# Altium project multi_channel.PrjPcb (part 2 of 2)

## Sheet Filter6.SchDoc
size 420 x 297 mm; SheetNumber: 11; SheetTotal: 13
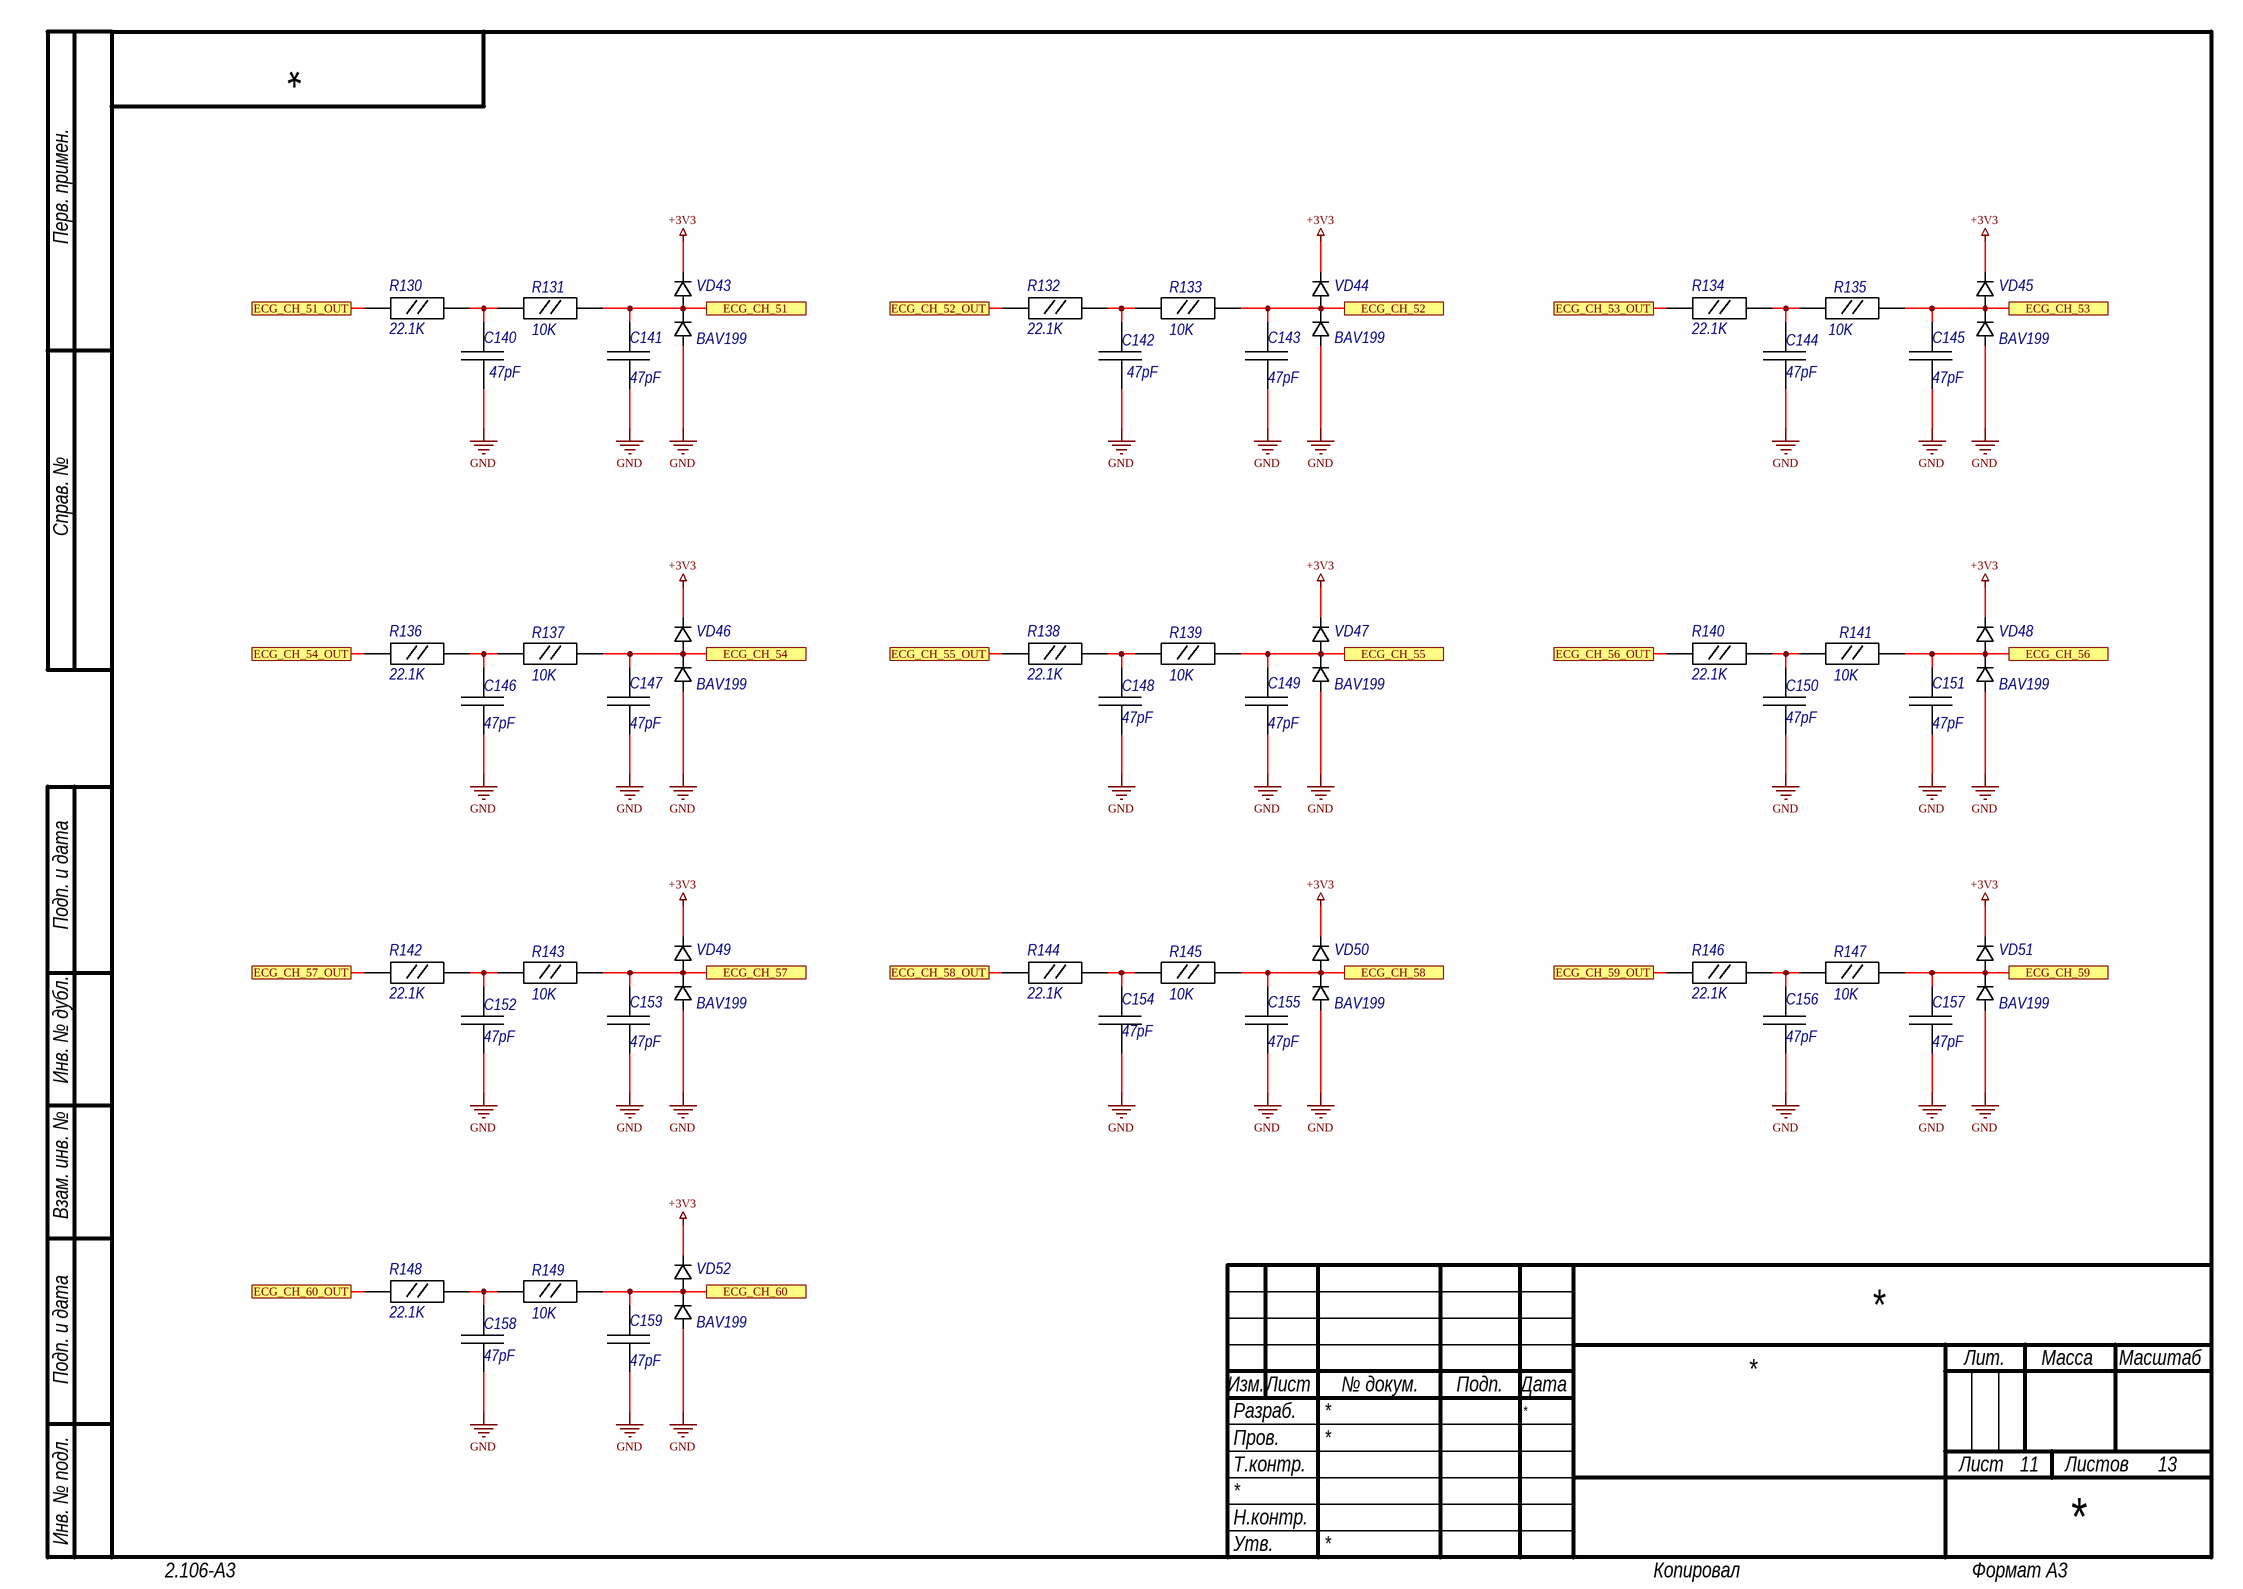
[diagram p10: Filter6.SchDoc]

### Parts
C140  47pF  [C0603]
C141  47pF  [C0603]
C142  47pF  [C0603]
C143  47pF  [C0603]
C144  47pF  [C0603]
C145  47pF  [C0603]
C146  47pF  [C0603]
C147  47pF  [C0603]
C148  47pF  [C0603]
C149  47pF  [C0603]
C150  47pF  [C0603]
C151  47pF  [C0603]
C152  47pF  [C0603]
C153  47pF  [C0603]
C154  47pF  [C0603]
C155  47pF  [C0603]
C156  47pF  [C0603]
C157  47pF  [C0603]
C158  47pF  [C0603]
C159  47pF  [C0603]
R130  22.1K  [R0603]
R131  10K  [R0603]
R132  22.1K  [R0603]
R133  10K  [R0603]
R134  22.1K  [R0603]
R135  10K  [R0603]
R136  22.1K  [R0603]
R137  10K  [R0603]
R138  22.1K  [R0603]
R139  10K  [R0603]
R140  22.1K  [R0603]
R141  10K  [R0603]
R142  22.1K  [R0603]
R143  10K  [R0603]
R144  22.1K  [R0603]
R145  10K  [R0603]
R146  22.1K  [R0603]
R147  10K  [R0603]
R148  22.1K  [R0603]
R149  10K  [R0603]
VD43  BAV199  [SOT23]
VD44  BAV199  [SOT23]
VD45  BAV199  [SOT23]
VD46  BAV199  [SOT23]
VD47  BAV199  [SOT23]
VD48  BAV199  [SOT23]
VD49  BAV199  [SOT23]
VD50  BAV199  [SOT23]
VD51  BAV199  [SOT23]
VD52  BAV199  [SOT23]

### Ports
ECG_CH_51, ECG_CH_51_OUT, ECG_CH_52, ECG_CH_52_OUT, ECG_CH_53, ECG_CH_53_OUT, ECG_CH_54, ECG_CH_54_OUT, ECG_CH_55, ECG_CH_55_OUT, ECG_CH_56, ECG_CH_56_OUT, ECG_CH_57, ECG_CH_57_OUT, ECG_CH_58, ECG_CH_58_OUT, ECG_CH_59, ECG_CH_59_OUT, ECG_CH_60, ECG_CH_60_OUT

### Nets
+3V3: VD43.2 VD44.2 VD45.2 VD46.2 VD47.2 VD48.2 VD49.2 VD50.2 VD51.2 VD52.2
GND: C140.1 C141.1 C142.1 C143.1 C144.1 C145.1 C146.1 C147.1 C148.1 C149.1 C150.1 C151.1 C152.1 C153.1 C154.1 C155.1 C156.1 C157.1 C158.1 C159.1 VD43.1 VD44.1 VD45.1 VD46.1 VD47.1 VD48.1 VD49.1 VD50.1 VD51.1 VD52.1
NetC140_2: C140.2 R130.2 R131.1
NetC141_2: C141.2 R131.2 VD43.3 ; port ECG_CH_51
NetC142_2: C142.2 R132.2 R133.1
NetC143_2: C143.2 R133.2 VD44.3 ; port ECG_CH_52
NetC144_2: C144.2 R134.2 R135.1
NetC145_2: C145.2 R135.2 VD45.3 ; port ECG_CH_53
NetC146_2: C146.2 R136.2 R137.1
NetC147_2: C147.2 R137.2 VD46.3 ; port ECG_CH_54
NetC148_2: C148.2 R138.2 R139.1
NetC149_2: C149.2 R139.2 VD47.3 ; port ECG_CH_55
NetC150_2: C150.2 R140.2 R141.1
NetC151_2: C151.2 R141.2 VD48.3 ; port ECG_CH_56
NetC152_2: C152.2 R142.2 R143.1
NetC153_2: C153.2 R143.2 VD49.3 ; port ECG_CH_57
NetC154_2: C154.2 R144.2 R145.1
NetC155_2: C155.2 R145.2 VD50.3 ; port ECG_CH_58
NetC156_2: C156.2 R146.2 R147.1
NetC157_2: C157.2 R147.2 VD51.3 ; port ECG_CH_59
NetC158_2: C158.2 R148.2 R149.1
NetC159_2: C159.2 R149.2 VD52.3 ; port ECG_CH_60
NetR130_1: R130.1 ; port ECG_CH_51_OUT
NetR132_1: R132.1 ; port ECG_CH_52_OUT
NetR134_1: R134.1 ; port ECG_CH_53_OUT
NetR136_1: R136.1 ; port ECG_CH_54_OUT
NetR138_1: R138.1 ; port ECG_CH_55_OUT
NetR140_1: R140.1 ; port ECG_CH_56_OUT
NetR142_1: R142.1 ; port ECG_CH_57_OUT
NetR144_1: R144.1 ; port ECG_CH_58_OUT
NetR146_1: R146.1 ; port ECG_CH_59_OUT
NetR148_1: R148.1 ; port ECG_CH_60_OUT

### Notes on the sheet
- Перв. примен.
- Справ. №
- Подп. и дата
- Инв. № дубл.
- Взам. инв. №
- Разраб.
- Изм.
- Лист
- № докум.
- Подп.
- Дата
- Лит.
- Масса
- Масштаб
- Пров.
- Т.контр.
- Листов
- Инв. № подл.
- Утв.
- Н.контр.
- 2.106-A3
- Копировал
- Формат А3

### Library data of the parts
C140-C159 = CC_SMD_0603: Ceramic Capacitor SMD; Package: 0603; Value: 47pF
R130-R149 = R0603: Resistor SMD
  R130 R132 R134 R136 R138 R140 R142 R144 R146 R148: Value: 22.1K
  R131 R133 R135 R137 R139 R141 R143 R145 R147 R149: Value: 10K
VD43-VD52 = DIODE_BAV199: Diod Schottky; Diode Type: Standard; Package: SOT-23; PartNumber: BAV199; Manufacturer Part Number 1: BAV199

## Sheet Connectors.SchDoc
size 420 x 297 mm; SheetNumber: 13; SheetTotal: 13
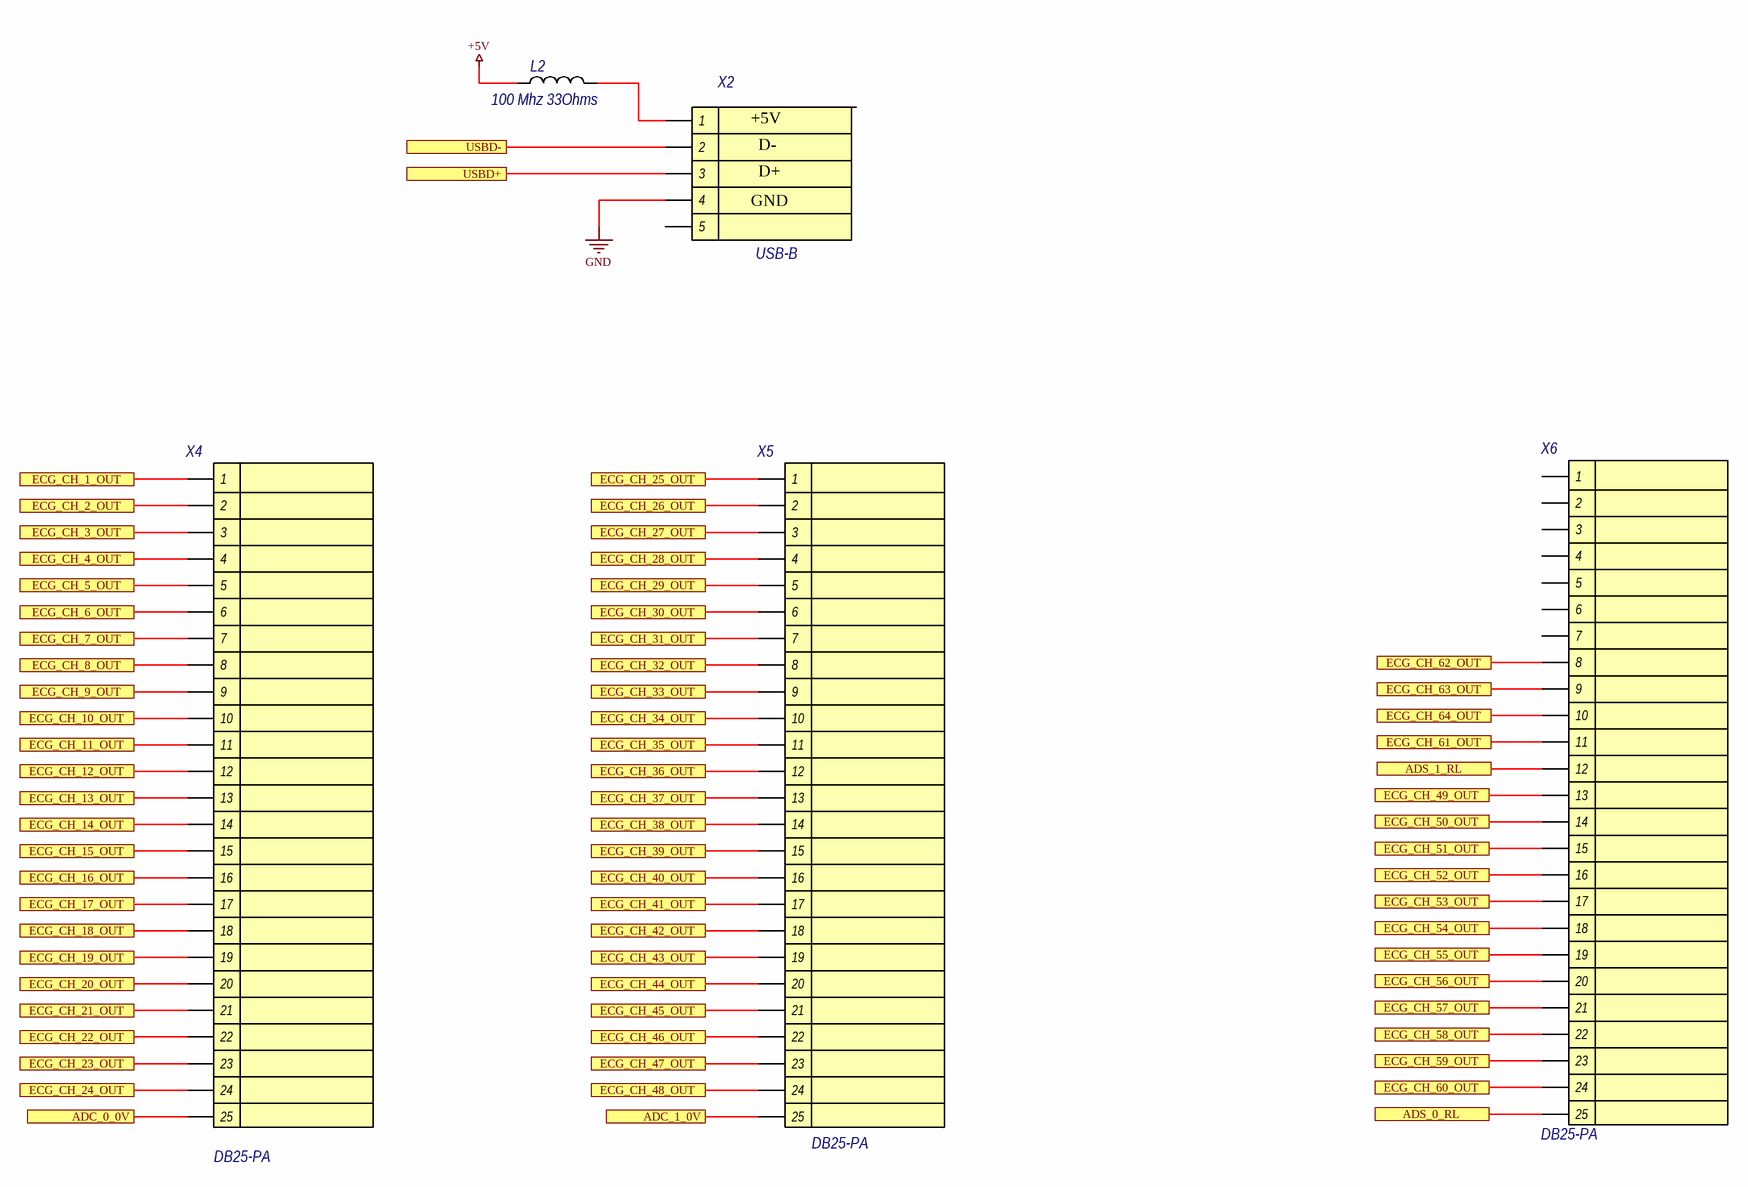
[diagram p11: Connectors.SchDoc]

### Parts
L2  100 Mhz 33Ohms  [1206]
X2  USB-B  [USB-B]
X4  DB25-PA  [DB25_FEMALE]
X5  DB25-PA  [DB25_FEMALE]
X6  DB25-PA  [DB25_FEMALE]

### Ports
ADC_0_0V, ADC_1_0V, ADS_0_RL, ADS_1_RL, ECG_CH_1_OUT, ECG_CH_2_OUT, ECG_CH_3_OUT, ECG_CH_4_OUT, ECG_CH_5_OUT, ECG_CH_6_OUT, ECG_CH_7_OUT, ECG_CH_8_OUT, ECG_CH_9_OUT, ECG_CH_10_OUT, ECG_CH_11_OUT, ECG_CH_12_OUT, ECG_CH_13_OUT, ECG_CH_14_OUT, ECG_CH_15_OUT, ECG_CH_16_OUT, ECG_CH_17_OUT, ECG_CH_18_OUT, ECG_CH_19_OUT, ECG_CH_20_OUT, ECG_CH_21_OUT, ECG_CH_22_OUT, ECG_CH_23_OUT, ECG_CH_24_OUT, ECG_CH_25_OUT, ECG_CH_26_OUT, ECG_CH_27_OUT, ECG_CH_28_OUT, ECG_CH_29_OUT, ECG_CH_30_OUT, ECG_CH_31_OUT, ECG_CH_32_OUT, ECG_CH_33_OUT, ECG_CH_34_OUT, ECG_CH_35_OUT, ECG_CH_36_OUT, ECG_CH_37_OUT, ECG_CH_38_OUT, ECG_CH_39_OUT, ECG_CH_40_OUT, ECG_CH_41_OUT, ECG_CH_42_OUT, ECG_CH_43_OUT, ECG_CH_44_OUT, ECG_CH_45_OUT, ECG_CH_46_OUT, ECG_CH_47_OUT, ECG_CH_48_OUT, ECG_CH_49_OUT, ECG_CH_50_OUT, ECG_CH_51_OUT, ECG_CH_52_OUT, ECG_CH_53_OUT, ECG_CH_54_OUT, ECG_CH_55_OUT, ECG_CH_56_OUT, ECG_CH_57_OUT, ECG_CH_58_OUT, ECG_CH_59_OUT, ECG_CH_60_OUT, ECG_CH_61_OUT, ECG_CH_62_OUT, ECG_CH_63_OUT, ECG_CH_64_OUT, USBD+, USBD-

### Nets
+5V: L2.1
GND: X2.4
NetB1_1: X4.25 ; port ADC_0_0V
NetB2_1: X5.25 ; port ADC_1_0V
NetDD2_15: X2.3 ; port USBD+
NetDD2_16: X2.2 ; port USBD-
NetL2_2: L2.2 X2.1
NetR13_1: X6.25 ; port ADS_0_RL
NetR19_1: X6.11 ; port ECG_CH_61_OUT
NetR21_1: X6.8 ; port ECG_CH_62_OUT
NetR34_1: X6.12 ; port ADS_1_RL
NetR38_1: X6.9 ; port ECG_CH_63_OUT
NetR50_1: X4.1 ; port ECG_CH_1_OUT
NetR52_1: X4.2 ; port ECG_CH_2_OUT
NetR54_1: X4.3 ; port ECG_CH_3_OUT
NetR56_1: X4.4 ; port ECG_CH_4_OUT
NetR58_1: X4.5 ; port ECG_CH_5_OUT
NetR60_1: X4.6 ; port ECG_CH_6_OUT
NetR62_1: X4.7 ; port ECG_CH_7_OUT
NetR64_1: X4.8 ; port ECG_CH_8_OUT
NetR66_1: X4.9 ; port ECG_CH_9_OUT
NetR68_1: X4.10 ; port ECG_CH_10_OUT
NetR70_1: X4.11 ; port ECG_CH_11_OUT
NetR72_1: X4.12 ; port ECG_CH_12_OUT
NetR74_1: X4.13 ; port ECG_CH_13_OUT
NetR76_1: X4.14 ; port ECG_CH_14_OUT
NetR78_1: X4.15 ; port ECG_CH_15_OUT
NetR80_1: X4.16 ; port ECG_CH_16_OUT
NetR82_1: X4.17 ; port ECG_CH_17_OUT
NetR84_1: X4.18 ; port ECG_CH_18_OUT
NetR86_1: X4.19 ; port ECG_CH_19_OUT
NetR88_1: X4.20 ; port ECG_CH_20_OUT
NetR90_1: X5.7 ; port ECG_CH_31_OUT
NetR92_1: X5.8 ; port ECG_CH_32_OUT
NetR94_1: X5.9 ; port ECG_CH_33_OUT
NetR96_1: X5.10 ; port ECG_CH_34_OUT
NetR98_1: X5.11 ; port ECG_CH_35_OUT
NetR100_1: X5.12 ; port ECG_CH_36_OUT
NetR102_1: X5.13 ; port ECG_CH_37_OUT
NetR104_1: X5.14 ; port ECG_CH_38_OUT
NetR106_1: X5.15 ; port ECG_CH_39_OUT
NetR108_1: X5.16 ; port ECG_CH_40_OUT
NetR110_1: X5.17 ; port ECG_CH_41_OUT
NetR112_1: X5.18 ; port ECG_CH_42_OUT
NetR114_1: X5.19 ; port ECG_CH_43_OUT
NetR116_1: X5.20 ; port ECG_CH_44_OUT
NetR118_1: X5.21 ; port ECG_CH_45_OUT
NetR120_1: X5.22 ; port ECG_CH_46_OUT
NetR122_1: X5.23 ; port ECG_CH_47_OUT
NetR124_1: X5.24 ; port ECG_CH_48_OUT
NetR126_1: X6.13 ; port ECG_CH_49_OUT
NetR128_1: X6.14 ; port ECG_CH_50_OUT
NetR130_1: X6.15 ; port ECG_CH_51_OUT
NetR132_1: X6.16 ; port ECG_CH_52_OUT
NetR134_1: X6.17 ; port ECG_CH_53_OUT
NetR136_1: X6.18 ; port ECG_CH_54_OUT
NetR138_1: X6.19 ; port ECG_CH_55_OUT
NetR140_1: X6.20 ; port ECG_CH_56_OUT
NetR142_1: X6.21 ; port ECG_CH_57_OUT
NetR144_1: X6.22 ; port ECG_CH_58_OUT
NetR146_1: X6.23 ; port ECG_CH_59_OUT
NetR148_1: X6.24 ; port ECG_CH_60_OUT
NetR151_1: X6.10 ; port ECG_CH_64_OUT
NetR158_1: X4.21 ; port ECG_CH_21_OUT
NetR160_1: X4.22 ; port ECG_CH_22_OUT
NetR162_1: X4.23 ; port ECG_CH_23_OUT
NetR164_1: X4.24 ; port ECG_CH_24_OUT
NetR166_1: X5.1 ; port ECG_CH_25_OUT
NetR168_1: X5.2 ; port ECG_CH_26_OUT
NetR170_1: X5.3 ; port ECG_CH_27_OUT
NetR172_1: X5.4 ; port ECG_CH_28_OUT
NetR174_1: X5.5 ; port ECG_CH_29_OUT
NetR176_1: X5.6 ; port ECG_CH_30_OUT

Not connected (* = marked no-connect by the designer): X2 5; X6 1 2 3 4 5 6 7

### Notes on the sheet
- +5V
- D-
- GND
- D+
- Перв. примен.
- Справ. №
- Подп. и дата
- Инв. № дубл.
- Взам. инв. №
- Разраб.
- Изм.
- Лист
- № докум.
- Подп.
- Дата
- Лит.
- Масса
- Масштаб
- Пров.
- Т.контр.
- Листов
- Инв. № подл.
- Утв.
- Н.контр.
- 2.106-A3
- Копировал
- Формат А3

### Library data of the parts
L2 = IND_BLM31PG330SN1L: Ferrite Bead; Manufacturer 1: Coilcraft; Tolerance: ±10%; SCDType: spec; Package: 1206; PartNumber: BLM31PG330SN1L; Manufacturer Part Number 1: 100 Mhz 33Ohms
X2 = CONN_USB-B: STD USB TYPE B; Manufacturer: TE Connectivity; Part Number: 292317-4; Desc: Разъем на плату
X4-X6 = CONN_DB25_FEMALE: Value: DB25-PA; PartNumber: DB25-PA

## Sheet Filter7.SchDoc
size 420 x 297 mm; SheetNumber: 13; SheetTotal: 13
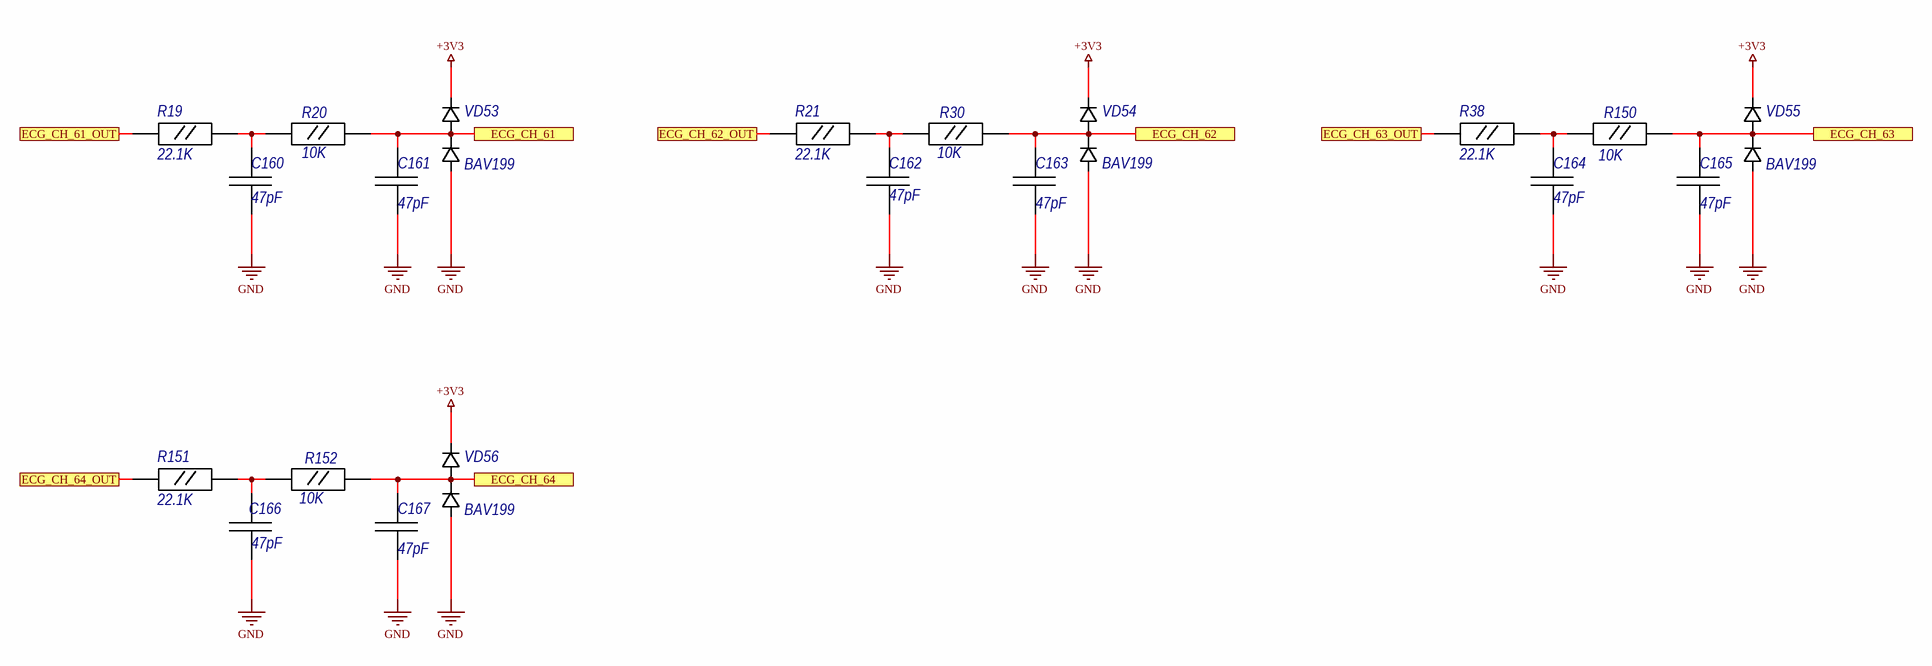
[diagram p12: Filter7.SchDoc]

### Parts
C160  47pF  [C0603]
C161  47pF  [C0603]
C162  47pF  [C0603]
C163  47pF  [C0603]
C164  47pF  [C0603]
C165  47pF  [C0603]
C166  47pF  [C0603]
C167  47pF  [C0603]
R19  22.1K  [R0603]
R20  10K  [R0603]
R21  22.1K  [R0603]
R30  10K  [R0603]
R38  22.1K  [R0603]
R150  10K  [R0603]
R151  22.1K  [R0603]
R152  10K  [R0603]
VD53  BAV199  [SOT23]
VD54  BAV199  [SOT23]
VD55  BAV199  [SOT23]
VD56  BAV199  [SOT23]

### Ports
ECG_CH_61, ECG_CH_61_OUT, ECG_CH_62, ECG_CH_62_OUT, ECG_CH_63, ECG_CH_63_OUT, ECG_CH_64, ECG_CH_64_OUT

### Nets
+3V3: VD53.2 VD54.2 VD55.2 VD56.2
GND: C160.1 C161.1 C162.1 C163.1 C164.1 C165.1 C166.1 C167.1 VD53.1 VD54.1 VD55.1 VD56.1
NetC160_2: C160.2 R19.2 R20.1
NetC161_2: C161.2 R20.2 VD53.3 ; port ECG_CH_61
NetC162_2: C162.2 R21.2 R30.1
NetC163_2: C163.2 R30.2 VD54.3 ; port ECG_CH_62
NetC164_2: C164.2 R38.2 R150.1
NetC165_2: C165.2 R150.2 VD55.3 ; port ECG_CH_63
NetC166_2: C166.2 R151.2 R152.1
NetC167_2: C167.2 R152.2 VD56.3 ; port ECG_CH_64
NetR19_1: R19.1 ; port ECG_CH_61_OUT
NetR21_1: R21.1 ; port ECG_CH_62_OUT
NetR38_1: R38.1 ; port ECG_CH_63_OUT
NetR151_1: R151.1 ; port ECG_CH_64_OUT

### Notes on the sheet
- Перв. примен.
- Справ. №
- Подп. и дата
- Инв. № дубл.
- Взам. инв. №
- Разраб.
- Изм.
- Лист
- № докум.
- Подп.
- Дата
- Лит.
- Масса
- Масштаб
- Пров.
- Т.контр.
- Листов
- Инв. № подл.
- Утв.
- Н.контр.
- 2.106-A3
- Копировал
- Формат А3

### Library data of the parts
C160-C167 = CC_SMD_0603: Ceramic Capacitor SMD; Package: 0603; Value: 47pF
R19-R21 R30 R38 R150-R152 = R0603: Resistor SMD
  R19 R21 R38 R151: Value: 22.1K
  R20 R30 R150 R152: Value: 10K
VD53-VD56 = DIODE_BAV199: Diod Schottky; Diode Type: Standard; Package: SOT-23; PartNumber: BAV199; Manufacturer Part Number 1: BAV199

## Nets that join several sheets
+3V3: MCU (21 pins), ADC_0 (23 pins), ADC_0_MUL (24 pins), ADC_1 (20 pins), ADC_1_MUL (24 pins), Filter1 (10 pins), Filter2 (10 pins), Filter3 (10 pins), Filter4 (10 pins), Filter5 (10 pins), Filter6 (10 pins), Filter7 (VD53.2 VD54.2 VD55.2 VD56.2)
+5V: MCU (10 pins), Connectors (L2.1)
GND: MCU (37 pins), ADC_0 (29 pins), ADC_0_MUL (16 pins), ADC_1 (27 pins), ADC_1_MUL (16 pins), Filter1 (30 pins), Filter2 (30 pins), Filter3 (30 pins), Filter4 (30 pins), Filter5 (30 pins), Filter6 (30 pins), Connectors (X2.4), Filter7 (12 pins)
NetB1_1: ADC_0 (8 pins), Connectors (X4.25)
NetB1_2: ADC_0 (B1.2), ADC_0_MUL (DD3.8)
NetB1_4: ADC_0 (B1.4), ADC_0_MUL (DD8.8)
NetB1_6: ADC_0 (B1.6), ADC_0_MUL (DD6.8)
NetB1_8: ADC_0 (B1.8), ADC_0_MUL (DD7.8)
NetB1_10: ADC_0 (B1.10), ADC_1_MUL (DD16.8)
NetB1_12: ADC_0 (B1.12), ADC_1_MUL (DD17.8)
NetB1_14: ADC_0 (B1.14), ADC_1_MUL (DD15.8)
NetB1_16: ADC_0 (B1.16), ADC_1_MUL (DD18.8)
NetB1_34: MCU (R17.1), ADC_0 (B1.34), ADC_1 (B2.34)
NetB1_37: ADC_0 (B1.37 DA2.3), ADC_1 (B2.37)
NetB1_38: MCU (DD1.52), ADC_0 (B1.38 R40.2)
NetB1_39: MCU (DD1.48), ADC_0 (B1.39 R36.1)
NetB1_40: MCU (R10.1), ADC_0 (B1.40), ADC_1 (B2.40)
NetB1_43: MCU (R18.1), ADC_0 (B1.43), ADC_1 (B2.43)
NetB1_47: MCU (DD1.51), ADC_0 (B1.47 R15.1)
NetB2_1: ADC_1 (8 pins), Connectors (X5.25)
NetB2_2: ADC_0_MUL (DD10.8), ADC_1 (B2.2)
NetB2_4: ADC_1 (B2.4), ADC_1_MUL (DD11.8)
NetB2_6: ADC_0_MUL (DD9.8), ADC_1 (B2.6)
NetB2_8: ADC_1 (B2.8), ADC_1_MUL (DD14.8)
NetB2_10: ADC_1 (B2.10), ADC_1_MUL (DD12.8)
NetB2_12: ADC_1 (B2.12), ADC_1_MUL (DD13.8)
NetB2_14: ADC_0_MUL (DD4.8), ADC_1 (B2.14)
NetB2_16: ADC_0_MUL (DD5.8), ADC_1 (B2.16)
NetB2_38: MCU (DD1.26), ADC_1 (B2.38 R184.2)
NetB2_39: MCU (DD1.29), ADC_1 (B2.39 R182.1)
NetB2_47: MCU (DD1.30), ADC_1 (B2.47 R41.1)
NetC61_2: ADC_0_MUL (DD4.4), Filter1 (C61.2 R51.2 VD3.3)
NetC63_2: ADC_0_MUL (DD4.2), Filter1 (C63.2 R53.2 VD4.3)
NetC65_2: ADC_0_MUL (DD4.9), Filter1 (C65.2 R55.2 VD5.3)
NetC67_2: ADC_0_MUL (DD4.7), Filter1 (C67.2 R57.2 VD6.3)
NetC69_2: ADC_0_MUL (DD3.4), Filter1 (C69.2 R59.2 VD7.3)
NetC71_2: ADC_0_MUL (DD3.2), Filter1 (C71.2 R61.2 VD8.3)
NetC73_2: ADC_0_MUL (DD3.9), Filter1 (C73.2 R63.2 VD9.3)
NetC75_2: ADC_0_MUL (DD3.7), Filter1 (C75.2 R65.2 VD10.3)
NetC77_2: ADC_0_MUL (DD6.4), Filter1 (C77.2 R67.2 VD11.3)
NetC79_2: ADC_0_MUL (DD6.2), Filter1 (C79.2 R69.2 VD12.3)
NetC81_2: ADC_0_MUL (DD6.9), Filter2 (C81.2 R71.2 VD13.3)
NetC83_2: ADC_0_MUL (DD6.7), Filter2 (C83.2 R73.2 VD14.3)
NetC85_2: ADC_0_MUL (DD5.4), Filter2 (C85.2 R75.2 VD15.3)
NetC87_2: ADC_0_MUL (DD5.2), Filter2 (C87.2 R77.2 VD16.3)
NetC89_2: ADC_0_MUL (DD5.9), Filter2 (C89.2 R79.2 VD17.3)
NetC91_2: ADC_0_MUL (DD5.7), Filter2 (C91.2 R81.2 VD18.3)
NetC93_2: ADC_0_MUL (DD8.4), Filter2 (C93.2 R83.2 VD19.3)
NetC95_2: ADC_0_MUL (DD8.2), Filter2 (C95.2 R85.2 VD20.3)
NetC97_2: ADC_0_MUL (DD8.9), Filter2 (C97.2 R87.2 VD21.3)
NetC99_2: ADC_0_MUL (DD8.7), Filter2 (C99.2 R89.2 VD22.3)
NetC101_2: ADC_0_MUL (DD9.4), Filter4 (C101.2 R91.2 VD23.3)
NetC103_2: ADC_0_MUL (DD9.2), Filter4 (C103.2 R93.2 VD24.3)
NetC105_2: ADC_1_MUL (DD12.9), Filter4 (C105.2 R95.2 VD25.3)
NetC107_2: ADC_1_MUL (DD12.7), Filter4 (C107.2 R97.2 VD26.3)
NetC109_2: ADC_1_MUL (DD12.4), Filter4 (C109.2 R99.2 VD27.3)
NetC111_2: ADC_1_MUL (DD12.2), Filter4 (C111.2 R101.2 VD28.3)
NetC113_2: ADC_1_MUL (DD11.2), Filter4 (C113.2 R103.2 VD29.3)
NetC115_2: ADC_1_MUL (DD11.9), Filter4 (C115.2 R105.2 VD30.3)
NetC117_2: ADC_1_MUL (DD11.7), Filter4 (C117.2 R107.2 VD31.3)
NetC119_2: ADC_1_MUL (DD11.4), Filter4 (C119.2 R109.2 VD32.3)
NetC121_2: ADC_1_MUL (DD14.9), Filter5 (C121.2 R111.2 VD33.3)
NetC123_2: ADC_1_MUL (DD14.7), Filter5 (C123.2 R113.2 VD34.3)
NetC125_2: ADC_1_MUL (DD14.4), Filter5 (C125.2 R115.2 VD35.3)
NetC127_2: ADC_1_MUL (DD14.2), Filter5 (C127.2 R117.2 VD36.3)
NetC129_2: ADC_1_MUL (DD13.9), Filter5 (C129.2 R119.2 VD37.3)
NetC131_2: ADC_1_MUL (DD13.7), Filter5 (C131.2 R121.2 VD38.3)
NetC133_2: ADC_1_MUL (DD13.4), Filter5 (C133.2 R123.2 VD39.3)
NetC135_2: ADC_1_MUL (DD13.2), Filter5 (C135.2 R125.2 VD40.3)
NetC137_2: ADC_1_MUL (DD16.2), Filter5 (C137.2 R127.2 VD41.3)
NetC139_2: ADC_1_MUL (DD16.4), Filter5 (C139.2 R129.2 VD42.3)
NetC141_2: ADC_1_MUL (DD16.7), Filter6 (C141.2 R131.2 VD43.3)
NetC143_2: ADC_1_MUL (DD16.9), Filter6 (C143.2 R133.2 VD44.3)
NetC145_2: ADC_1_MUL (DD15.2), Filter6 (C145.2 R135.2 VD45.3)
NetC147_2: ADC_1_MUL (DD15.4), Filter6 (C147.2 R137.2 VD46.3)
NetC149_2: ADC_1_MUL (DD15.7), Filter6 (C149.2 R139.2 VD47.3)
NetC151_2: ADC_1_MUL (DD15.9), Filter6 (C151.2 R141.2 VD48.3)
NetC153_2: ADC_1_MUL (DD18.2), Filter6 (C153.2 R143.2 VD49.3)
NetC155_2: ADC_1_MUL (DD18.4), Filter6 (C155.2 R145.2 VD50.3)
NetC157_2: ADC_1_MUL (DD18.7), Filter6 (C157.2 R147.2 VD51.3)
NetC159_2: ADC_1_MUL (DD18.9), Filter6 (C159.2 R149.2 VD52.3)
NetC161_2: ADC_1_MUL (DD17.9), Filter7 (C161.2 R20.2 VD53.3)
NetC163_2: ADC_1_MUL (DD17.2), Filter7 (C163.2 R30.2 VD54.3)
NetC165_2: ADC_1_MUL (DD17.4), Filter7 (C165.2 R150.2 VD55.3)
NetC167_2: ADC_1_MUL (DD17.7), Filter7 (C167.2 R152.2 VD56.3)
NetC169_2: ADC_0_MUL (DD7.4), Filter3 (C169.2 R159.2 VD57.3)
NetC171_2: ADC_0_MUL (DD7.2), Filter3 (C171.2 R161.2 VD58.3)
NetC173_2: ADC_0_MUL (DD7.9), Filter3 (C173.2 R163.2 VD59.3)
NetC175_2: ADC_0_MUL (DD7.7), Filter3 (C175.2 R165.2 VD60.3)
NetC177_2: ADC_0_MUL (DD10.9), Filter3 (C177.2 R167.2 VD61.3)
NetC179_2: ADC_0_MUL (DD10.7), Filter3 (C179.2 R169.2 VD62.3)
NetC181_2: ADC_0_MUL (DD10.4), Filter3 (C181.2 R171.2 VD63.3)
NetC183_2: ADC_0_MUL (DD10.2), Filter3 (C183.2 R173.2 VD64.3)
NetC185_2: ADC_0_MUL (DD9.9), Filter3 (C185.2 R175.2 VD65.3)
NetC187_2: ADC_0_MUL (DD9.7), Filter3 (C187.2 R177.2 VD66.3)
NetDD1_34: MCU (DD1.34), ADC_0_MUL (DD10.1)
NetDD1_35: MCU (DD1.35), ADC_0_MUL (DD10.10)
NetDD1_36: MCU (DD1.36), ADC_1_MUL (DD11.1)
NetDD1_38: MCU (DD1.38), ADC_1_MUL (DD11.10)
NetDD1_39: MCU (DD1.39), ADC_0_MUL (DD9.1)
NetDD1_40: MCU (DD1.40), ADC_0_MUL (DD9.10)
NetDD1_41: MCU (DD1.41), ADC_1_MUL (DD14.1)
NetDD1_42: MCU (DD1.42), ADC_1_MUL (DD14.10)
NetDD1_43: MCU (DD1.43), ADC_1_MUL (DD12.1)
NetDD1_44: MCU (DD1.44), ADC_1_MUL (DD12.10)
NetDD1_45: MCU (DD1.45), ADC_1_MUL (DD13.1)
NetDD1_46: MCU (DD1.46), ADC_1_MUL (DD13.10)
NetDD1_47: MCU (DD1.47), ADC_0_MUL (DD5.10)
NetDD1_53: MCU (DD1.53), ADC_0_MUL (DD5.1)
NetDD1_54: MCU (DD1.54), ADC_0_MUL (DD4.1)
NetDD1_55: MCU (DD1.55), ADC_0_MUL (DD4.10)
NetDD1_56: MCU (DD1.56), ADC_0_MUL (DD8.1)
NetDD1_57: MCU (DD1.57), ADC_0_MUL (DD8.10)
NetDD1_58: MCU (DD1.58), ADC_0_MUL (DD3.1)
NetDD1_59: MCU (DD1.59), ADC_0_MUL (DD3.10)
NetDD1_60: MCU (DD1.60), ADC_0_MUL (DD7.1)
NetDD1_61: MCU (DD1.61), ADC_0_MUL (DD7.10)
NetDD1_62: MCU (DD1.62), ADC_0_MUL (DD6.1)
NetDD1_63: MCU (DD1.63), ADC_0_MUL (DD6.10)
NetDD1_64: MCU (DD1.64), ADC_1_MUL (DD16.1)
NetDD1_65: MCU (DD1.65), ADC_1_MUL (DD16.10)
NetDD1_66: MCU (DD1.66), ADC_1_MUL (DD17.1)
NetDD1_67: MCU (DD1.67), ADC_1_MUL (DD17.10)
NetDD1_68: MCU (DD1.68), ADC_1_MUL (DD15.1)
NetDD1_69: MCU (DD1.69), ADC_1_MUL (DD15.10)
NetDD1_70: MCU (DD1.70), ADC_1_MUL (DD18.1)
NetDD1_71: MCU (DD1.71), ADC_1_MUL (DD18.10)
NetDD2_15: MCU (DD2.15), Connectors (X2.3)
NetDD2_16: MCU (DD2.16), Connectors (X2.2)
NetR13_1: ADC_0 (R13.1), Connectors (X6.25)
NetR19_1: Connectors (X6.11), Filter7 (R19.1)
NetR21_1: Connectors (X6.8), Filter7 (R21.1)
NetR34_1: ADC_1 (R34.1), Connectors (X6.12)
NetR38_1: Connectors (X6.9), Filter7 (R38.1)
NetR50_1: Filter1 (R50.1), Connectors (X4.1)
NetR52_1: Filter1 (R52.1), Connectors (X4.2)
NetR54_1: Filter1 (R54.1), Connectors (X4.3)
NetR56_1: Filter1 (R56.1), Connectors (X4.4)
NetR58_1: Filter1 (R58.1), Connectors (X4.5)
NetR60_1: Filter1 (R60.1), Connectors (X4.6)
NetR62_1: Filter1 (R62.1), Connectors (X4.7)
NetR64_1: Filter1 (R64.1), Connectors (X4.8)
NetR66_1: Filter1 (R66.1), Connectors (X4.9)
NetR68_1: Filter1 (R68.1), Connectors (X4.10)
NetR70_1: Filter2 (R70.1), Connectors (X4.11)
NetR72_1: Filter2 (R72.1), Connectors (X4.12)
NetR74_1: Filter2 (R74.1), Connectors (X4.13)
NetR76_1: Filter2 (R76.1), Connectors (X4.14)
NetR78_1: Filter2 (R78.1), Connectors (X4.15)
NetR80_1: Filter2 (R80.1), Connectors (X4.16)
NetR82_1: Filter2 (R82.1), Connectors (X4.17)
NetR84_1: Filter2 (R84.1), Connectors (X4.18)
NetR86_1: Filter2 (R86.1), Connectors (X4.19)
NetR88_1: Filter2 (R88.1), Connectors (X4.20)
NetR90_1: Filter4 (R90.1), Connectors (X5.7)
NetR92_1: Filter4 (R92.1), Connectors (X5.8)
NetR94_1: Filter4 (R94.1), Connectors (X5.9)
NetR96_1: Filter4 (R96.1), Connectors (X5.10)
NetR98_1: Filter4 (R98.1), Connectors (X5.11)
NetR100_1: Filter4 (R100.1), Connectors (X5.12)
NetR102_1: Filter4 (R102.1), Connectors (X5.13)
NetR104_1: Filter4 (R104.1), Connectors (X5.14)
NetR106_1: Filter4 (R106.1), Connectors (X5.15)
NetR108_1: Filter4 (R108.1), Connectors (X5.16)
NetR110_1: Filter5 (R110.1), Connectors (X5.17)
NetR112_1: Filter5 (R112.1), Connectors (X5.18)
NetR114_1: Filter5 (R114.1), Connectors (X5.19)
NetR116_1: Filter5 (R116.1), Connectors (X5.20)
NetR118_1: Filter5 (R118.1), Connectors (X5.21)
NetR120_1: Filter5 (R120.1), Connectors (X5.22)
NetR122_1: Filter5 (R122.1), Connectors (X5.23)
NetR124_1: Filter5 (R124.1), Connectors (X5.24)
NetR126_1: Filter5 (R126.1), Connectors (X6.13)
NetR128_1: Filter5 (R128.1), Connectors (X6.14)
NetR130_1: Filter6 (R130.1), Connectors (X6.15)
NetR132_1: Filter6 (R132.1), Connectors (X6.16)
NetR134_1: Filter6 (R134.1), Connectors (X6.17)
NetR136_1: Filter6 (R136.1), Connectors (X6.18)
NetR138_1: Filter6 (R138.1), Connectors (X6.19)
NetR140_1: Filter6 (R140.1), Connectors (X6.20)
NetR142_1: Filter6 (R142.1), Connectors (X6.21)
NetR144_1: Filter6 (R144.1), Connectors (X6.22)
NetR146_1: Filter6 (R146.1), Connectors (X6.23)
NetR148_1: Filter6 (R148.1), Connectors (X6.24)
NetR151_1: Connectors (X6.10), Filter7 (R151.1)
NetR158_1: Filter3 (R158.1), Connectors (X4.21)
NetR160_1: Filter3 (R160.1), Connectors (X4.22)
NetR162_1: Filter3 (R162.1), Connectors (X4.23)
NetR164_1: Filter3 (R164.1), Connectors (X4.24)
NetR166_1: Filter3 (R166.1), Connectors (X5.1)
NetR168_1: Filter3 (R168.1), Connectors (X5.2)
NetR170_1: Filter3 (R170.1), Connectors (X5.3)
NetR172_1: Filter3 (R172.1), Connectors (X5.4)
NetR174_1: Filter3 (R174.1), Connectors (X5.5)
NetR176_1: Filter3 (R176.1), Connectors (X5.6)